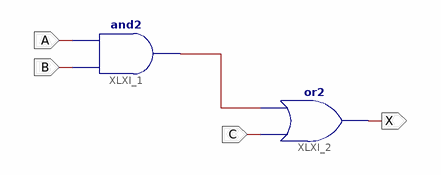
[diagram p0: schematic sheet 1]
// Xilinx ISE schematic Circuit1.sch (spartan3e) as structural Verilog: 2 symbols, 4 ports
module Circuit1 (
  input  A,
  input  B,
  input  C,
  output X
);

  wire XLXN_6;

  and XLXI_1 (XLXN_6, B, A);
  or XLXI_2 (X, C, XLXN_6);
endmodule
